# EAGLE board SCH1001-001-009-320 - ALU Bottom (EAGLE 9.4.2), part 1 of 2
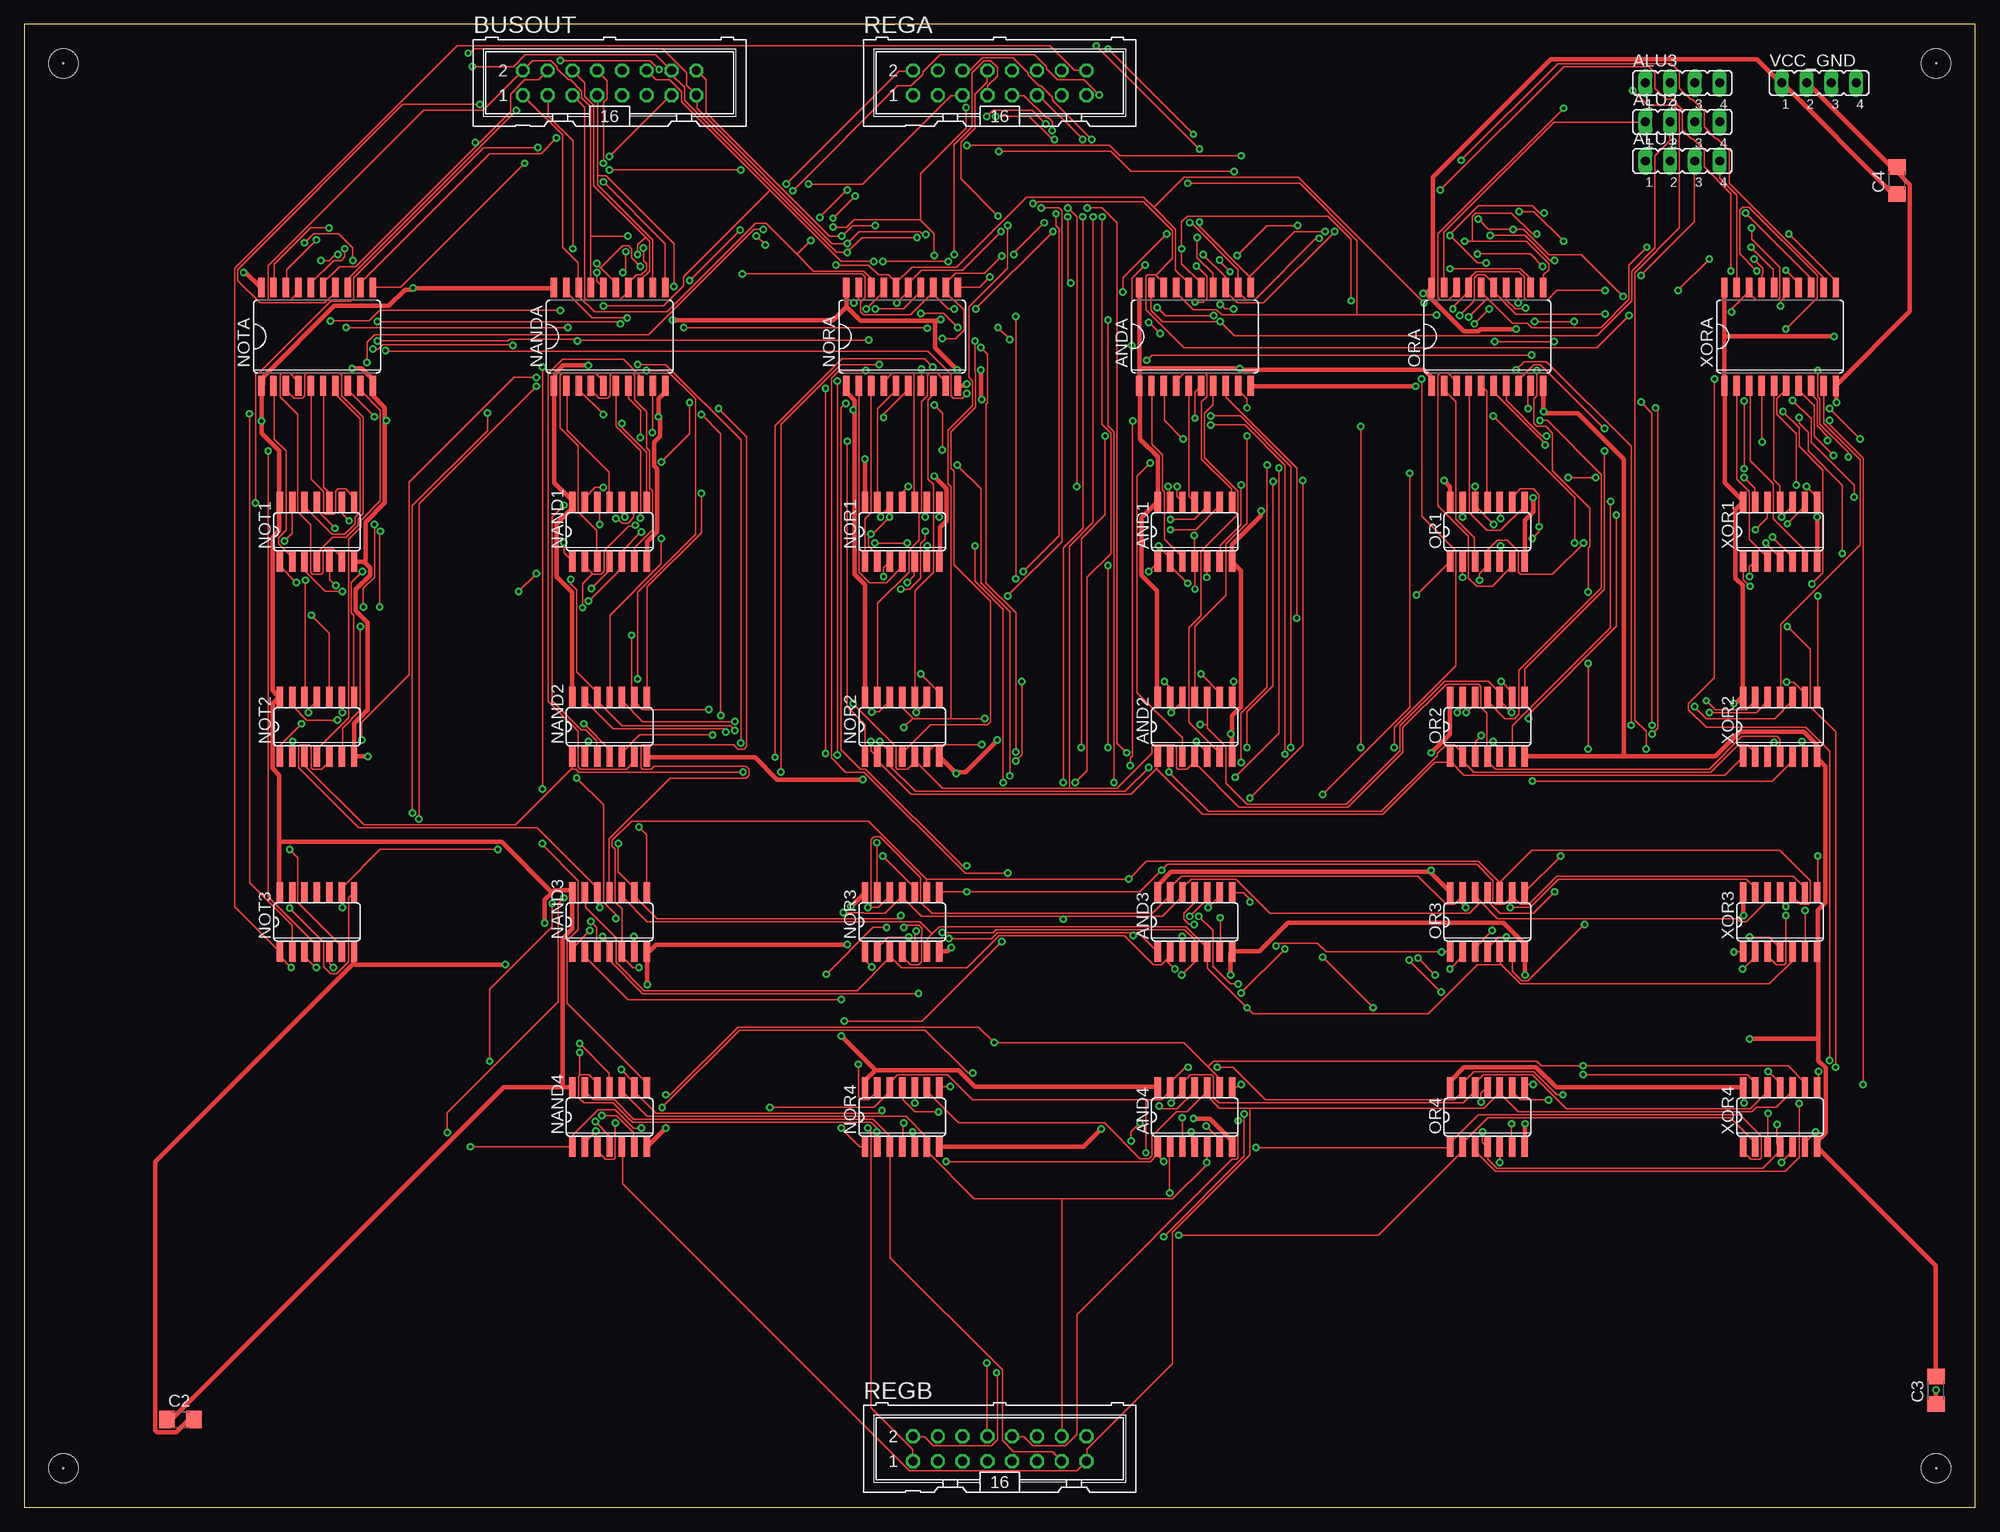
[diagram p3: board, top side]
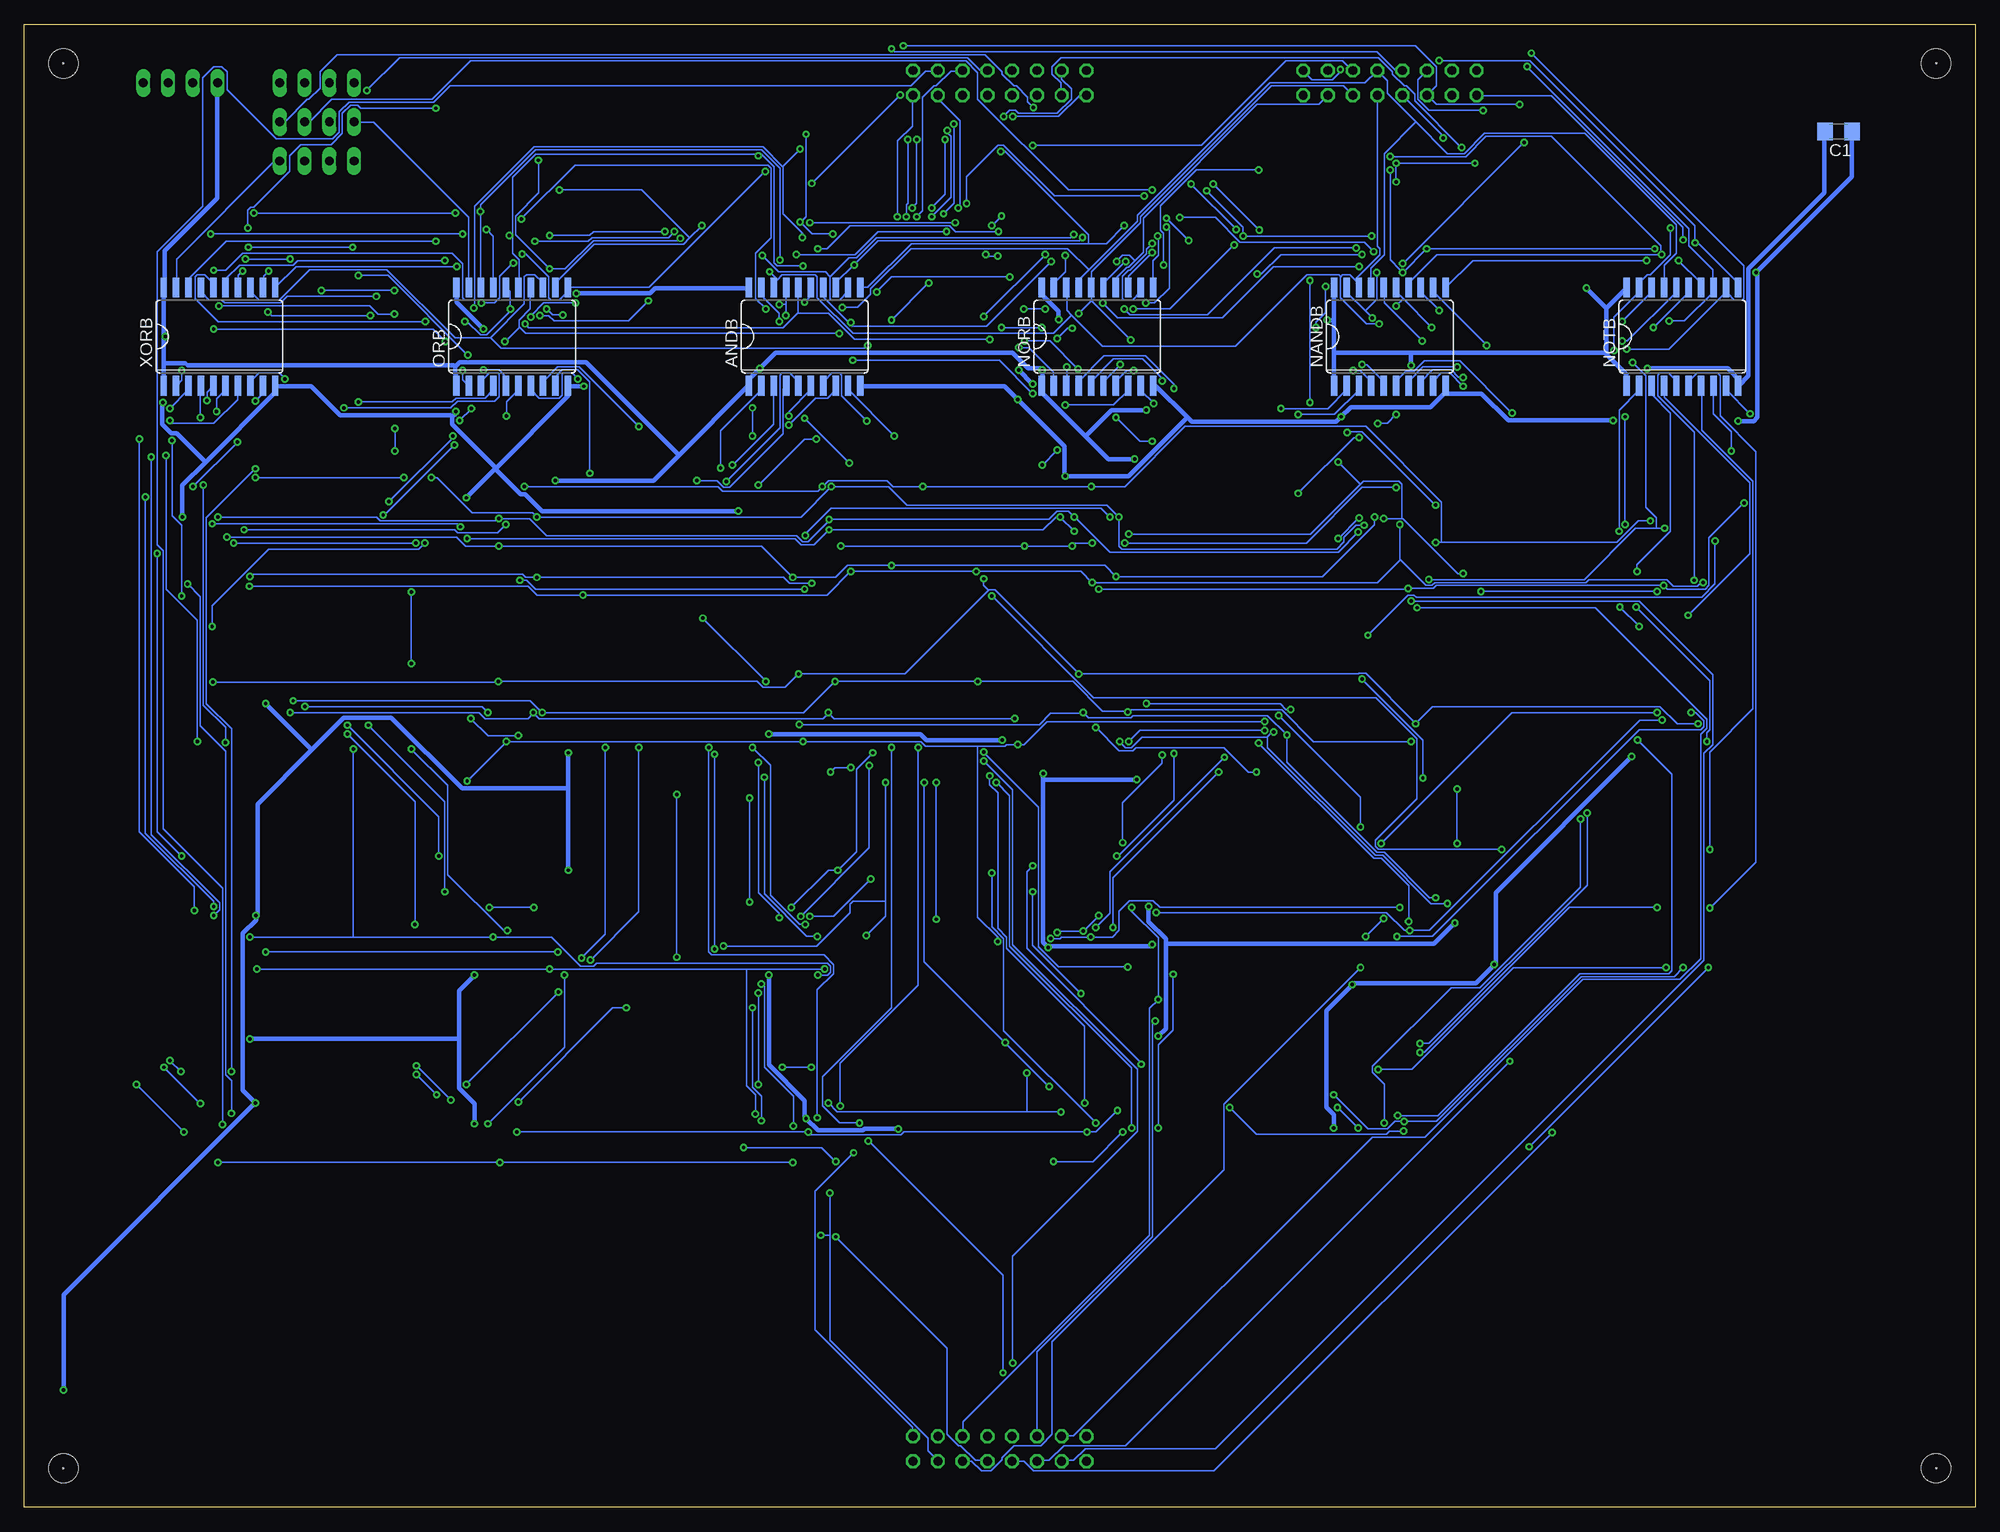
[diagram p4: board, bottom side, seen from below]

Size 200 x 152 mm. Coordinates in mm from the lower left corner, seen from the top.
Outline: 0,0 200,0 200,152 0,152 0,0
Copper layers (1*16): Top 0.035mm / dielectric 1.5mm / Bottom 0.035mm
Design rules "default *": minimum track width 6mil, minimum drill 0.35mm, track to track 6mil, track to pad 6mil, pad to pad 6mil, via to via 6mil, smd to smd 6mil, copper to edge 40mil, drill to drill 6mil, minimum pad ring 10mil, minimum via ring 8mil, stop-mask expansion 4mil, vias tented up to drill 0mil, thermal gap 10mil
Net classes: 1 power: width 0.457 mm
Holes 0.12 mm at 4,4 196,148 4,148 196,4
Holes 3 mm at 4,148 4,4 196,4 196,148

## Footprints (pad centres in the part's own frame; a part is rotated, then mirrored left to right if it is on the bottom)
JP4 = drill 0.914 long: 1 -3.81,0; 2 -1.27,0; 3 1.27,0; 4 3.81,0
SO14 = smd 0.66 x 2.032: 1 -3.81,-3.073; 2 -2.54,-3.073; 3 -1.27,-3.073; 4 0,-3.073; 5 1.27,-3.073; 6 2.54,-3.073; 7 3.81,-3.073; 8 3.81,3.073; 9 2.54,3.073; 10 1.27,3.073; 11 0,3.073; 12 -1.27,3.073; 13 -2.54,3.073; 14 -3.81,3.073
SO20W = smd 0.66 x 2.032: 1 -5.715,-5.029; 2 -4.445,-5.029; 3 -3.175,-5.029; 4 -1.905,-5.029; 5 -0.635,-5.029; 6 0.635,-5.029; 7 1.905,-5.029; 8 3.175,-5.029; 9 4.445,-5.029; 10 5.715,-5.029; 11 5.715,5.029; 12 4.445,5.029; 13 3.175,5.029; 14 1.905,5.029; 15 0.635,5.029; 16 -0.635,5.029; 17 -1.905,5.029; 18 -3.175,5.029; 19 -4.445,5.029; 20 -5.715,5.029
ML16 = drill 0.914 octagon: 1 -8.89,-1.27; 2 -8.89,1.27; 3 -6.35,-1.27; 4 -6.35,1.27; 5 -3.81,-1.27; 6 -3.81,1.27; 7 -1.27,-1.27; 8 -1.27,1.27; 9 1.27,-1.27; 10 1.27,1.27; 11 3.81,-1.27; 12 3.81,1.27; 13 6.35,-1.27; 14 6.35,1.27; 15 8.89,-1.27; 16 8.89,1.27
C1206 = smd 1.6 x 1.8: 1 -1.4,0; 2 1.4,0

## Placement (x,y rotation side)
ALU1  [JP4]  170,138 0 top
ALU2  [JP4]  170,142 0 top
ALU3  [JP4]  170,146 0 top
AND1  74ALS08D  [SO14]  120,100 0 top
AND2  74ALS08D  [SO14]  120,80 0 top
AND3  74ALS08D  [SO14]  120,60 0 top
AND4  74ALS08D  [SO14]  120,40 0 top
ANDA  74AC245DW  [SO20W]  120,120 0 top
ANDB  74AC245DW  [SO20W]  120,120 0 bottom
BUSOUT  [ML16]  60,146 0 top
C1  1uF  [C1206]  14,141 180 bottom
C2  1uF  [C1206]  16,9 0 top
C3  1uF  [C1206]  196,12 90 top
C4  1uF  [C1206]  192,136 90 top
NAND1  74ALS00D  [SO14]  60,100 0 top
NAND2  74ALS00D  [SO14]  60,80 0 top
NAND3  74ALS00D  [SO14]  60,60 0 top
NAND4  74ALS00D  [SO14]  60,40 0 top
NANDA  74AC245DW  [SO20W]  60,120 0 top
NANDB  74AC245DW  [SO20W]  60,120 0 bottom
NOR1  74ALS02D  [SO14]  90,100 0 top
NOR2  74ALS02D  [SO14]  90,80 0 top
NOR3  74ALS02D  [SO14]  90,60 0 top
NOR4  74ALS02D  [SO14]  90,40 0 top
NORA  74AC245DW  [SO20W]  90,120 0 top
NORB  74AC245DW  [SO20W]  90,120 0 bottom
NOT1  74ALS04D  [SO14]  30,100 0 top
NOT2  74ALS04D  [SO14]  30,80 0 top
NOT3  74ALS04D  [SO14]  30,60 0 top
NOTA  74AC245DW  [SO20W]  30,120 0 top
NOTB  74AC245DW  [SO20W]  30,120 0 bottom
OR1  74LS32D  [SO14]  150,100 0 top
OR2  74LS32D  [SO14]  150,80 0 top
OR3  74LS32D  [SO14]  150,60 0 top
OR4  74LS32D  [SO14]  150,40 0 top
ORA  74AC245DW  [SO20W]  150,120 0 top
ORB  74AC245DW  [SO20W]  150,120 0 bottom
REGA  [ML16]  100,146 0 top
REGB  [ML16]  100,6 0 top
VCC_GND  [JP4]  184,146 0 top
XOR1  74LS86D  [SO14]  180,100 0 top
XOR2  74LS86D  [SO14]  180,80 0 top
XOR3  74LS86D  [SO14]  180,60 0 top
XOR4  74LS86D  [SO14]  180,40 0 top
XORA  74AC245DW  [SO20W]  180,120 0 top
XORB  74AC245DW  [SO20W]  180,120 0 bottom

## Tracks (layer width: path | path; a pad name or v marks a point on that pad's centre or on a via)
!AND  (via drill 0.35)
  Top 0.152: ANDA.19 115.52,124.97 115.52,122.68 116.66,121.54 v122.61,121.54 124.05,120.09 161.24,120.09 164.82,123.67 164.82,126.72 167.18,129.08 167.18,138.53 168.71,140.06 168.71,141.96 ALU2.2
  Bottom 0.152: v122.61,121.54 122.61,122.38 124.44,124.21 124.44,124.97 ANDB.19
!NAND  (via drill 0.35)
  Top 0.152: v61.8,121.92 58.22,121.92 55.63,124.51 55.63,124.97 NANDA.19 | v81.53,132.21 v84.35,135.03 | v61.65,128.7 61.65,126.87 v61.34,126.57
  Bottom 0.152: 62.52,122.64 64.39,124.51 64.39,124.97 NANDB.19 | 62.52,122.64 v61.8,121.92 | v84.35,135.03 92.96,135.03 102.26,144.32 102.26,147.07 103.48,148.28 154.23,148.28 158.19,144.32 168.48,144.32 170.76,142.04 171.22,142.04 ALU2.3 | v81.53,132.21 77.88,132.21 75.36,129.69 62.64,129.69 v61.65,128.7 | v61.34,126.57 61.34,123.83 62.52,122.64
!NOR  (via drill 0.35)
  Top 0.152: v85.04,123.44 85.5,123.9 85.5,124.97 NORA.19 | v82.91,131.22 84.28,131.22 85.04,131.98 91.82,131.98 91.86,131.94 | 91.86,131.94 93.27,130.53 v93.27,128.32 | v96.55,143.49 96.55,141.35 91.9,136.7 91.9,131.98 91.86,131.94
  Bottom 0.152: v85.04,123.44 84.12,123.44 82.6,124.97 82.6,130.91 v82.91,131.22 | v93.27,128.32 93.27,126.64 94.41,125.5 94.41,125.04 NORB.19 | v96.55,143.49 97.16,144.09 97.16,144.55 98.3,145.69 98.53,145.69 99.75,146.91 99.75,147.14 101.5,148.9 167.94,148.9 169.7,147.14 169.7,145.47 170.84,144.32 170.99,144.32 173.28,142.04 173.74,142.04 ALU2.4
!NOT  (via drill 0.35)
  Top 0.152: v31.24,131.14 29.34,131.14 25.6,127.41 25.6,125.04 NOTA.19 | v165.74,126.26 171.22,131.75 171.22,138 ALU1.3 | v154.53,118.11 115.59,118.11 v115.06,117.58 | v96.62,114.15 96.16,113.69 95.25,113.69 95.02,113.92 95.02,116.13 92.66,118.49 37.11,118.49 v37.03,118.57
  Bottom 0.152: v31.24,131.14 31.24,128.4 33.3,126.34 33.6,126.34 34.44,125.5 34.44,125.04 NOTB.19 34.52,124.97 34.52,124.51 37.03,122 v37.03,118.57 | v165.74,126.26 162.69,126.26 v154.53,118.11 | v115.06,117.58 100.05,117.58 v96.62,114.15
!OR
  Top 0.152: ORA.19 145.54,125.04 145.54,130.68 156.82,141.96 166.12,141.96 ALU2.1
  Bottom 0.152: ORB.19 154.46,125.04 154.46,132.21 164.21,141.96 166.12,141.96 ALU2.1
!XOR
  Top 0.152: XORA.19 175.56,125.04 175.56,134.49 173.81,136.25 ALU1.4
  Bottom 0.152: XORB.19 184.4,125.04 184.4,127.94 174.35,138 ALU1.4
BUSOUT0  (via drill 0.35)
  Top 0.152: v29.95,129.92 26.9,126.87 26.9,125.04 NOTA.18 | BUSOUT.1 51.13,144.7 55.17,140.66 55.17,129.16 56.77,127.56 56.77,125.04 NANDA.18 56.84,124.97 56.84,124.13 58.45,122.53 65.91,122.53 74.98,131.6 76.05,131.6 79.21,128.44 | 79.21,128.44 80.92,126.72 86.03,126.72 86.79,125.96 86.79,125.04 NORA.18 | 116.01,126.3 115.98,126.34 115.14,126.34 114.99,126.19 114.99,122.76 118.87,118.87 161.24,118.87 v164.52,122.15 | 116.01,126.3 116.81,125.5 116.81,125.04 ANDA.18 | v175.03,122.53 175.03,122.83 176.78,124.59 176.78,124.97 XORA.18 176.78,124.51 177.55,123.75 179.76,123.75 179.98,123.98 179.98,127.1 177.09,130 v177.09,131.14 | v157.81,143.41 144.93,130.53 144.93,123.98 145.16,123.75 146,123.75 146.76,124.51 146.76,124.97 ORA.18 | v80.62,129.84 79.21,128.44 | v85.19,134.42 v82.91,132.13 | v103.4,133.66 103.78,133.66 103.94,133.81 114.76,133.81 117.73,130.84 117.73,128.02 116.01,126.3
  Bottom 0.152: v29.95,129.92 29.95,131.22 43.43,144.7 51.05,144.7 BUSOUT.1 | v164.52,122.15 174.65,122.15 v175.03,122.53 | v157.81,143.41 165.51,143.41 165.81,143.71 166.57,143.71 167.41,142.88 167.41,140.82 168.55,139.68 171.68,139.68 172.82,138.53 172.82,136.93 176.48,133.27 176.78,133.27 177.09,132.97 v177.09,131.14 | v82.91,132.13 v80.62,129.84 | v85.19,134.42 94.41,134.42 99.59,139.6 100.2,139.6 103.4,136.4 v103.4,133.66
BUSOUT1  (via drill 0.35)
  Top 0.152: v144.78,122.22 136.63,122.22 | 136.63,122.22 122.76,122.22 122.22,122.76 119.86,122.76 118.11,124.51 118.11,124.97 ANDA.17 | v146.46,122.83 146.46,122.99 148.06,124.59 148.06,124.97 ORA.17 148.13,125.04 148.13,125.96 148.82,126.64 153.24,126.64 153.77,126.11 153.77,123.98 154,123.75 156.13,123.75 157.12,124.74 v162.08,124.74 | v177.32,127.94 178.23,127.03 178.23,126.42 178.16,126.34 178.16,125.04 XORA.17 | v169.54,124.74 v172.75,127.94 | NOTA.17 28.04,124.97 28.04,124.51 27.28,123.75 25.15,123.75 24.99,123.9 24.99,127.25 40.92,143.18 47.02,143.18 51.05,147.22 BUSOUT.2 51.13,147.29 52.12,148.28 54.03,148.28 54.63,147.68 54.63,147.45 55.78,146.3 56.01,146.3 57.15,145.16 57.15,144.47 58.06,143.56 58.06,130.3 | 58.06,130.3 58.06,125.04 NANDA.17 | v86.33,122.83 88.09,124.59 88.09,124.97 NORA.17 | v75.06,130.3 v75.97,129.39 | 58.06,130.3 v61.87,130.3 | 136.63,122.22 136.63,129.84 130.76,135.71 v119.25,135.71 | v110.19,144.78 108.66,146.3 105.92,146.3 104.78,147.45 104.78,147.68 103.56,148.9 93.88,148.9 92.13,147.14 92.13,146.91 90.91,145.69 89.53,145.69 v78.79,134.95
  Bottom 0.152: v144.78,122.22 145.85,122.22 v146.46,122.83 | v172.75,127.94 v177.32,127.94 | v162.08,124.74 v169.54,124.74 | v86.33,122.83 82.53,122.83 v75.97,129.39 | v61.87,130.3 v75.06,130.3 75.06,131.22 v78.79,134.95 | v110.19,144.78 v119.25,135.71
BUSOUT2  (via drill 0.35)
  Top 0.152: v32.84,129.01 32.84,128.17 32.46,127.79 31.7,127.79 29.41,125.5 29.41,125.04 NOTA.16 | v58.67,126.57 58.67,125.73 59.36,125.04 NANDA.16 | v56.24,129.01 56.24,140.06 53.72,142.57 53.72,144.7 BUSOUT.3 | 150,123.94 152.55,121.39 154.08,121.39 154.53,120.93 161.62,120.93 164.52,123.83 164.52,127.33 v166.34,129.16 | 150,123.94 149.43,124.51 149.43,124.97 ORA.16 | v177.01,129.16 179.3,126.87 179.3,125.04 XORA.16 | 115.79,133.24 118.03,130.99 118.03,126.8 119.33,125.5 119.33,125.04 ANDA.16 | 115.79,133.24 114.76,134.26 102.72,134.26 95.56,127.1 90.98,127.1 89.38,125.5 89.38,125.04 NORA.16 89.38,125.58 88.62,126.34 87.55,126.34 86.56,127.33 v83.21,127.33 | v148.06,122 150,123.94 | v143.49,123.44 130.61,136.32 118.87,136.32 115.79,133.24 | v73.46,137.08 v59.97,137.08
  Bottom 0.152: v32.84,129.01 v56.24,129.01 v58.67,126.57 58.67,126.64 58.9,126.87 58.98,126.87 59.97,127.86 v59.97,137.08 | v177.01,129.16 v166.34,129.16 | v148.06,122 148.06,122.15 146.76,123.44 v143.49,123.44 | v73.46,137.08 79.86,137.08 83.52,133.43 83.52,130.91 83.21,130.61 v83.21,127.33
BUSOUT3  (via drill 0.35)
  Top 0.152: 46.48,139.68 49.84,143.03 49.84,144.86 51.28,146.3 52.73,146.3 53.65,147.22 BUSOUT.4 | 46.48,139.68 33.98,127.18 32.31,127.18 30.71,125.58 30.71,125.04 NOTA.15 | v58.67,127.48 59.09,127.06 | 59.09,127.06 60.58,125.58 60.58,125.04 NANDA.15 | 46.48,139.68 v46.25,139.9 | v162.08,122.3 152.93,122.3 150.65,124.59 150.65,124.97 ORA.15 150.57,125.04 150.57,125.5 149.73,126.34 148.97,126.34 148.67,126.03 148.67,123.67 v147.14,122.15 | v180.06,123.14 180.06,123.6 180.59,124.13 180.59,124.97 XORA.15 | v100.13,130.76 96.16,126.8 91.97,126.8 90.68,125.5 90.68,125.04 NORA.15 90.6,124.97 90.6,124.59 v89.46,123.44 | ANDA.15 120.62,125.04 120.62,125.5 118.64,127.48 v118.64,129.01 118.64,131.75 119.25,132.36 133.66,132.36 136.02,130 v136.02,123.67 | 59.09,127.06 61.34,129.31 61.95,129.31 62.26,129.01 62.26,128.09 v63.17,127.18
  Bottom 0.152: v46.25,139.9 v58.67,127.48 | v162.08,122.3 163.75,122.3 164.59,123.14 v180.06,123.14 | v100.13,130.76 104.55,130.76 105.16,131.37 115.37,131.37 117.73,129.01 v118.64,129.01 | v147.14,122.15 146.23,122.15 145.69,121.61 138.07,121.61 v136.02,123.67 | v63.17,127.18 71.93,127.18 77.19,121.92 87.94,121.92 v89.46,123.44
BUSOUT4  (via drill 0.35)
  Top 0.152: v120.24,130.15 120.24,128.09 121.84,126.49 121.84,125.04 ANDA.14 | v153.92,122.91 153.54,122.91 153.47,122.83 152.86,122.83 151.94,123.75 151.94,124.97 ORA.14 | v180.59,126.8 181.89,125.5 181.89,125.04 XORA.14 | v46.71,143.79 38.79,143.79 21.87,126.87 21.87,125.73 24.16,123.44 30.79,123.44 31.85,124.51 31.85,124.97 NOTA.14 | BUSOUT.5 56.24,144.7 57.45,143.49 57.45,123.98 57.68,123.75 61.04,123.75 61.87,124.59 61.87,124.97 NANDA.14 61.95,125.04 61.95,125.5 62.79,126.34 63.25,126.34 63.78,126.87 63.78,127.48 63.48,127.79 v63.48,129.08 | v87.25,122.83 90.14,122.83 91.9,124.59 91.9,124.97 NORA.14 | v109.88,149.81 v120.47,139.22
  Bottom 0.152: v120.24,130.15 120.24,130.61 122.22,132.59 122.22,137.39 122.26,137.43 | 122.26,137.43 124.28,139.45 147.75,139.45 153.85,133.35 153.85,123.75 | 153.85,123.75 153.85,122.99 v153.92,122.91 | v180.59,126.8 179.38,126.8 177.62,128.55 156.13,128.55 155.07,127.48 155.07,123.98 154.84,123.75 153.85,123.75 | v46.71,143.79 55.24,143.79 56.16,144.7 BUSOUT.5 56.16,144.78 55.24,145.69 55.24,147.68 57.38,149.81 v109.88,149.81 | v87.25,122.83 86.64,122.22 78.72,122.22 71.86,129.08 v63.48,129.08 | v120.47,139.22 122.26,137.43
BUSOUT5  (via drill 0.35)
  Top 0.152: v50.44,143.18 33.22,125.96 33.22,125.04 NOTA.13 | 63.66,130.19 58.37,135.48 58.37,143.71 57.45,144.63 57.45,146 56.24,147.22 BUSOUT.6 | 63.66,130.19 64.08,129.77 64.08,126.72 63.25,125.88 63.25,125.04 NANDA.13 | v73.61,126.42 85.88,126.42 86.18,126.11 86.18,123.98 85.72,123.52 85.72,122.53 86.03,122.22 90.83,122.22 93.12,124.51 93.12,124.97 NORA.13 93.12,124.44 94.72,122.83 v95.33,122.83 | v62.87,128.4 62.87,129.39 63.66,130.19 | v120.85,128.4 123.14,126.11 123.14,125.04 ANDA.13 123.22,124.97 123.22,124.59 124.36,123.44 127.03,123.44 v134.34,130.76 | v97.54,122.83 v105.46,130.76 | v153.16,123.44 153.16,124.97 ORA.13 | v149.88,127.56 148.97,127.56 v146.15,130.38 146.23,130.38 146.23,130.61 149.05,133.43 154.61,133.43 155.37,132.66 v155.83,132.66 | v176.48,132.66 183.11,126.03 183.11,125.04 XORA.13
  Bottom 0.152: v50.44,143.18 56.01,143.18 57.15,144.32 57.15,146.3 56.24,147.22 BUSOUT.6 | v73.61,126.42 73.15,126.42 71.17,128.4 v62.87,128.4 | v120.85,128.4 114.83,128.4 112.47,130.76 v105.46,130.76 | v95.33,122.83 v97.54,122.83 | v153.16,123.44 151.79,123.44 151.26,123.98 151.26,126.19 v149.88,127.56 | v146.15,130.38 142.04,130.38 141.66,130.76 v134.34,130.76 | v155.83,132.66 v176.48,132.66
BUSOUT6  (via drill 0.35)
  Top 0.152: v54.56,140.36 52.96,138.76 47.7,138.76 34.52,125.58 34.52,125.04 NOTA.12 | 58.75,136.47 58.75,144.7 BUSOUT.7 | 58.75,136.47 58.75,135.56 64.39,129.92 64.39,125.04 NANDA.12 | v100.2,128.25 98.45,126.49 95.48,126.49 94.49,125.5 94.49,125.04 NORA.12 94.49,124.97 94.49,124.51 95.25,123.75 95.33,123.75 96.32,122.76 96.32,120.62 95.48,119.79 v94.11,119.79 | v101.42,128.4 101.42,128.55 v104.55,131.67 | v119.48,131.67 119.63,131.67 124.44,126.87 124.44,125.04 ANDA.12 124.51,124.97 124.51,124.51 125.27,123.75 126.11,123.75 132.44,130.07 v132.74,130.07 | v146.15,126.95 153.39,126.95 154.38,125.96 154.38,125.04 ORA.12 | v147.29,138.07 157.2,147.98 168.86,147.98 169.7,147.14 169.7,145.47 170.84,144.32 170.99,144.32 172.21,143.1 172.21,141.5 173.43,140.28 173.58,140.28 174.8,139.06 174.8,135.71 184.4,126.11 184.4,125.04 XORA.12 | 58.75,136.47 59.66,136.47 66.6,129.54 v66.6,125.12 | v67.59,120.93 92.51,120.93 v92.58,120.85
  Bottom 0.152: v54.56,140.36 54.56,140.59 58.67,144.7 BUSOUT.7 | v100.2,128.25 101.27,128.25 v101.42,128.4 | v119.48,131.67 v104.55,131.67 | v132.74,130.07 132.97,129.84 141.66,129.84 144.55,126.95 v146.15,126.95 149.66,130.45 149.66,132.36 147.29,134.72 v147.29,138.07 | v66.6,125.12 66.6,122.45 67.59,121.46 v67.59,120.93 | v92.58,120.85 93.04,120.85 v94.11,119.79
BUSOUT7  (via drill 0.35)
  Top 0.152: v51.28,137.77 38.56,125.04 35.74,125.04 NOTA.11 | v59.36,137.77 59.36,144.02 59.74,144.4 59.74,146.23 58.75,147.22 BUSOUT.8 | v59.36,135.87 65.68,129.54 65.68,125.04 NANDA.11 | v98.98,126.11 97.92,125.04 95.78,125.04 NORA.11 | v112.62,124.59 112.62,126.03 v117.12,130.53 | v120.47,131.75 120.47,131.29 125.62,126.15 | 125.62,126.15 125.65,126.11 125.65,125.04 ANDA.11 | v147.68,129.77 148.44,129.77 | 148.44,129.77 154,129.77 156.29,127.48 156.29,126.87 155.75,126.34 155.75,125.04 ORA.11 | v133.35,130.76 130.23,130.76 125.62,126.15 | v180.9,130.53 185.7,125.73 185.7,125.04 XORA.11 | v155.07,130.53 154.61,130.53 152.48,132.66 148.74,132.66 148.44,132.36 148.44,129.77 | v119.86,140.74 v111.1,149.5
  Bottom 0.152: v51.28,137.77 v59.36,137.77 v59.36,135.87 | v98.98,126.11 111.1,126.11 v112.62,124.59 | v117.12,130.53 119.25,130.53 v120.47,131.75 120.4,131.75 119.86,132.28 v119.86,140.74 | v147.68,129.77 142.19,129.77 141.81,130.15 133.96,130.15 v133.35,130.76 | v155.07,130.53 v180.9,130.53 | v111.1,149.5 110.8,149.2 61.34,149.2 59.44,147.29 58.75,147.29 BUSOUT.8
BUSOUT8  (via drill 0.35)
  Top 0.152: v153.24,132.82 154.76,132.82 v157.81,129.77 | v36.2,121.54 60.88,121.54 v61.11,121.31 | v122.53,127.86 122.53,127.71 v123.6,126.64
  Bottom 0.152: v157.81,129.77 179.3,129.77 183.11,125.96 183.11,125.04 XORB.18 | ORB.18 153.24,125.04 v153.24,132.82 153.24,133.5 147.6,139.14 124.44,139.14 122.53,137.24 v122.53,127.86 | v36.2,121.54 33.22,124.51 33.22,124.97 NOTB.18 | v61.11,121.31 62.41,121.31 65.08,123.98 65.08,126.11 65.04,126.15 | 65.04,126.15 64.85,126.34 64.08,126.34 63.59,125.84 | 63.59,125.84 63.25,125.5 63.25,125.04 NANDB.18 | 92.62,122.19 89.46,119.02 75.82,119.02 68.5,126.34 65.23,126.34 65.04,126.15 | 92.62,122.19 93.12,122.68 93.12,124.97 NORB.18 | 122.8,125.84 122.3,126.34 118.95,126.34 118.72,126.11 118.72,123.98 115.06,120.32 94.49,120.32 92.62,122.19 | 122.8,125.84 123.14,125.5 123.14,125.04 ANDB.18 | 63.59,125.84 61.04,128.4 61.04,129.01 61.27,129.24 61.27,144.7 BUSOUT.9 | 122.8,125.84 v123.6,126.64
BUSOUT9  (via drill 0.35)
  Top 0.152: v163.91,124.13 159.64,128.4 156.29,128.4 153.69,130.99 v152.63,130.99 150.11,130.99 v149.05,132.06 | v121.92,122.15 116.97,122.15 v116.13,122.99 | v123.98,122.83 123.06,122.83 v122.61,123.29
  Bottom 0.152: v152.63,130.99 151.94,130.3 151.94,125.04 ORB.17 | v163.91,124.13 173.05,124.13 173.74,123.44 179.45,123.44 179.76,123.75 181.05,123.75 181.89,124.59 181.89,124.97 XORB.17 | 57.34,142 60.27,144.93 60.27,146.23 61.27,147.22 BUSOUT.10 61.34,147.22 62.56,146 72.31,146 85.88,132.44 85.88,131.83 90.87,126.83 | 57.34,142 54.1,138.76 52.35,138.76 50.29,140.82 40.01,140.82 30.63,131.44 30.63,128.55 31.85,127.33 31.85,125.04 NOTB.17 | 57.34,142 60.58,138.76 60.58,128.4 61.95,127.03 61.95,125.04 NANDB.17 | 90.87,126.83 91.9,125.81 91.9,125.04 NORB.17 | v121.92,122.15 121.92,123.29 | 121.92,123.29 121.92,124.97 ANDB.17 | v116.13,122.99 114.61,122.99 113.23,124.36 113.23,124.89 109.12,129.01 93.04,129.01 90.87,126.83 | v149.05,132.06 143.56,137.54 123.75,137.54 123.44,137.24 123.44,130.15 125.04,128.55 125.04,123.9 v123.98,122.83 | 121.92,123.29 v122.61,123.29
BUSOUT10  (via drill 0.35)
  Top 0.152: v150.19,122.83 v148.67,121.31 | v154.84,121.54 v158.88,121.54 | v36.2,119.56 49.61,119.56 49.76,119.71 56.54,119.71 v56.69,119.56 56.69,119.63 v86.56,119.63 | v99.82,120.93 v101.04,119.71 | v95.71,120.93 94.26,122.38 v91.9,122.38
  Bottom 0.152: 120.74,122.42 122.22,120.93 148.28,120.93 v148.67,121.31 | 120.74,122.42 120.7,122.45 120.7,124.97 ANDB.16 | ORB.16 150.57,124.97 150.19,124.59 v150.19,122.83 150.19,122.61 152.63,120.17 153.24,120.17 154.61,121.54 v154.84,121.54 | v158.88,121.54 180.14,121.54 182.5,123.9 182.5,126.11 182.27,126.34 181.51,126.34 180.67,125.5 180.67,125.04 XORB.16 | v36.2,119.56 35.66,119.56 30.71,124.51 30.71,124.97 NOTB.16 | v56.69,119.56 60.58,123.44 60.58,124.97 NANDB.16 | BUSOUT.11 63.86,144.78 64.77,145.69 72.16,145.69 85.57,132.28 85.57,131.67 90.6,126.64 90.6,125.04 NORB.16 90.6,124.97 90.6,123.67 | 90.6,123.67 v86.56,119.63 | v101.04,119.71 114.91,119.71 117.58,122.38 120.7,122.38 120.74,122.42 | v95.71,120.93 v99.82,120.93 | 90.6,123.67 v91.9,122.38
BUSOUT11  (via drill 0.35)
  Top 0.152: v120.02,123.52 120.85,123.52 121.23,123.9 121.23,126.19 v120.17,127.25 | v156.9,127.79 156.44,127.79 153.85,130.38 v150.27,130.38 | v55.7,120.93 v32.99,120.93 | v87.1,127.71 83.74,127.71 76.47,134.99 | 76.47,134.99 67.36,144.09 67.36,145.09 66.14,146.3 64.77,146.3 63.86,147.22 BUSOUT.12 | v59.36,123.14 65.53,123.14 67.59,125.2 67.59,126.11 76.47,134.99 | v124.74,138.53 112.32,138.53 111.25,139.6 v96.62,139.6
  Bottom 0.152: v120.02,123.52 119.41,124.13 119.41,124.97 ANDB.15 | v120.17,127.25 122.83,127.25 123.14,127.56 123.14,137.39 124.44,138.68 124.74,138.68 | 124.74,138.68 147.6,138.68 149.96,136.32 149.96,130.38 | 149.96,130.38 149.96,128.55 149.28,127.86 149.28,125.12 149.35,125.04 ORB.15 | v156.9,127.79 171.98,127.79 172.44,127.33 177.93,127.33 179.3,125.96 179.3,125.04 XORB.15 | 149.96,130.38 v150.27,130.38 | v32.99,120.93 29.41,124.51 29.41,124.97 NOTB.15 | 58.64,123.86 59.36,124.59 59.36,124.97 NANDB.15 | 58.64,123.86 v55.7,120.93 | v87.1,127.71 89.31,125.5 89.31,125.04 NORB.15 | v59.36,123.14 58.64,123.86 | v124.74,138.53 124.74,138.68 | v96.62,139.6 79.32,139.6 70.64,148.28 64.85,148.28 63.86,147.29 BUSOUT.12
BUSOUT12  (via drill 0.35)
  Top 0.152: v30.4,127.79 31.24,127.79 31.85,128.4 v32.16,128.4 | v88.01,127.71 v94.72,127.71 | v115.29,121.46 v116.43,120.32 | v177.62,126.72 175.87,128.47 175.87,132.97 176.17,133.27 176.78,133.27 183.79,126.26 183.79,123.98 v180.59,120.78 | v150.72,119.48 v156.82,119.48 | v59.97,138.46 66.29,144.78 BUSOUT.13
  Bottom 0.152: v30.4,127.79 28.12,125.5 28.12,125.04 NOTB.14 | 32.23,128.4 55.17,128.4 58.06,125.5 58.06,125.04 NANDB.14 | 86.14,127.75 85.27,128.63 85.27,132.13 73.61,143.79 67.28,143.79 66.37,144.7 BUSOUT.13 | 86.14,127.75 86.79,127.1 86.94,127.1 88.09,125.96 88.09,125.04 NORB.14 | 115.41,121.35 115.14,121.08 101.35,121.08 v94.72,127.71 | 115.41,121.35 118.03,123.98 118.03,124.97 ANDB.14 | v88.01,127.71 87.4,128.32 86.72,128.32 86.14,127.75 | 149.24,120.97 148.59,120.32 v116.43,120.32 | 149.24,120.97 149.28,121.01 149.28,121.69 148.13,122.83 148.13,124.97 ORB.14 | 115.41,121.35 v115.29,121.46 | v177.62,126.72 178.08,126.26 178.08,125.04 XORB.14 | v180.59,120.78 158.12,120.78 v156.82,119.48 | 149.24,120.97 v150.72,119.48 | 32.23,128.4 32.23,129.31 43.43,140.51 50.14,140.51 52.2,138.46 v59.97,138.46 | 32.23,128.4 v32.16,128.4
BUSOUT13  (via drill 0.35)
  Top 0.152: v31.39,121.61 35.36,121.61 36.42,122.68 v54.94,122.68 | v91.52,130.15 85.88,130.15 v84.35,128.63 83.29,128.63 67.67,144.25 67.67,145.54 66.37,146.84 66.37,147.22 BUSOUT.14 66.29,147.29 64.69,148.9 51.36,148.9 50.14,147.68 v45.95,147.68 | v113.54,119.1 113.54,125.96 v114.91,127.33
  Bottom 0.152: 152.21,119.9 152.25,119.86 155.83,119.86 162.84,126.87 170.76,126.87 173.89,123.75 175.95,123.75 176.78,124.59 176.78,124.97 XORB.13 | 152.21,119.9 148.74,123.37 148.74,126.11 148.51,126.34 147.68,126.34 146.84,125.5 146.84,125.04 ORB.13 | v31.39,121.61 29.79,121.61 26.9,124.51 26.9,124.97 NOTB.13 26.9,125.04 26.9,126.87 29.34,129.31 29.34,131.06 v45.95,147.68 | v54.94,122.68 56.77,124.51 56.77,124.97 NANDB.13 | v84.35,128.63 86.79,126.19 86.79,125.04 NORB.13 | 114.95,127.37 112.47,129.84 91.82,129.84 v91.52,130.15 | 114.95,127.37 116.81,125.5 116.81,125.04 ANDB.13 | 152.21,119.9 151.1,118.8 113.84,118.8 v113.54,119.1 | v114.91,127.33 114.95,127.37
BUSOUT14  (via drill 0.35)
  Top 0.152: v35.74,118.72 36.27,118.72 36.73,119.18 49.99,119.18 v50.06,119.1 | v92.43,130.45 92.13,130.45 91.82,130.76 85.57,130.76 v84.35,129.54 82.83,129.54 68.96,143.41 68.96,144.7 BUSOUT.15 68.89,144.78 67.89,145.77 67.89,147.07 65.46,149.5 46.1,149.5 45.64,149.05 v45.49,149.05 | v130.53,131.37 127.41,131.37 v124.36,128.32 | v174.96,126.72 174.96,134.65 172.21,137.39 172.21,139.14 171.07,140.28 170.92,140.28 170,141.2 170,143.26 168.94,144.32 168.33,144.32 167.18,145.47 167.18,147.07 166.57,147.68 157.81,147.68 v145.16,135.03
  Bottom 0.152: v35.74,118.72 31.39,118.72 25.6,124.51 25.6,124.97 NOTB.12 25.6,124.44 25.38,124.44 24.69,123.75 23.85,123.75 23.7,123.9 23.7,127.25 v45.49,149.05 | v50.06,119.1 55.55,124.59 55.55,124.97 NANDB.12 | v84.35,129.54 84.96,128.93 84.96,128.47 86.64,126.8 86.79,126.8 87.4,126.19 87.4,123.9 87.25,123.75 86.41,123.75 85.57,124.59 85.57,124.97 NORB.12 | 117.39,126.15 115.44,128.09 114.68,128.09 112.62,130.15 92.73,130.15 v92.43,130.45 | 117.39,126.15 117.42,126.11 117.42,123.9 117.27,123.75 116.43,123.75 115.59,124.59 115.59,124.97 ANDB.12 | v130.53,131.37 131.79,130.11 | 131.79,130.11 132.44,129.46 141.58,129.46 145.54,125.5 145.54,125.04 ORB.12 | v124.36,128.32 122.68,126.64 117.88,126.64 117.39,126.15 | v174.96,126.72 175.49,126.19 175.49,125.04 XORB.12 | v145.16,135.03 136.7,135.03 131.79,130.11
BUSOUT15  (via drill 0.35)
  Top 0.152: v28.73,129.62 29.64,130.53 32.23,130.53 33.68,129.08 v33.68,127.79 | v148.97,128.47 154.38,128.47 v155.68,127.18 | BUSOUT.16 68.96,147.22 69.88,146.3 69.88,142.95 82.53,130.3 v83.82,130.3 84.89,131.37 v87.25,131.37 | v124.05,136.93 113.46,136.93 111.4,138.99 v99.9,138.99 | v54.94,148.28 64.16,148.28 v65.08,147.37
  Bottom 0.152: v33.68,127.79 51.51,127.79 54.25,125.04 NANDB.11 | NOTB.11 24.31,125.04 24.31,125.5 28.42,129.62 v28.73,129.62 28.73,131.37 45.64,148.28 v54.94,148.28 | v148.97,128.47 148.59,128.47 146.23,126.11 146.23,123.98 146,123.75 145.16,123.75 144.32,124.59 144.32,124.97 ORB.11 144.25,125.04 135.94,125.04 v124.05,136.93 | v155.68,127.18 172.14,127.18 174.27,125.04 XORB.11 | v83.82,130.3 83.74,130.23 83.74,128.32 84.28,127.79 84.28,125.04 NORB.11 | 90.91,129.54 89.08,129.54 v87.25,131.37 | 90.91,129.54 109.04,129.54 113.54,125.04 114.22,125.04 ANDB.11 | v99.9,138.99 99.44,138.99 90.91,130.45 90.91,129.54 | v65.08,147.37 65.08,147.14 65.91,146.3 67.97,146.3 68.89,147.22 BUSOUT.16
GND  (via drill 0.35)
  Top 0.457: v95.02,57.38 94.64,57 93.88,57 NOR3.7 | NOR2.7 93.88,76.89 v95.56,75.21 95.71,75.36 96.47,75.36 v99.75,78.64 | v85.95,74.6 77.19,74.6 74.91,76.89 63.86,76.89 NAND2.7 | v65.76,38.86 63.86,36.96 NAND4.7 | v63.86,53.57 63.86,56.92 NAND3.7 64.08,57 64.77,57.68 v84.35,57.68 | 33.76,55.78 13.41,35.43 13.41,7.92 13.64,7.7 15.54,7.7 16.84,8.99 17.37,8.99 C2.2 | 33.76,55.78 33.76,56.92 NOT3.7 | v49.3,55.63 33.91,55.63 33.76,55.78 | NANDA.10 65.68,114.91 65.68,114.3 65,113.61 v65,111.78 65.15,111.63 65.15,109.8 64.54,109.19 64.54,106.76 64.85,106.45 64.85,99.97 63.86,98.98 63.86,97 NAND1.7 | v93.27,105.69 94.56,104.39 94.56,101.12 93.88,100.43 93.88,97 NOR1.7 | v96.62,115.14 96.47,114.99 95.78,114.99 NORA.10 | v98.07,116.59 98.07,113.61 v98.15,113.54 | 34.82,96.93 35.43,96.32 35.43,95.56 33.98,94.11 33.98,91.9 35.2,90.68 35.2,81.76 33.83,80.39 33.83,76.96 NOT2.7 34.06,76.96 v35.2,76.96 | 34.82,96.93 33.83,96.93 NOT1.7 | 36.96,111.4 36.96,102.95 34.98,100.97 34.98,97.08 34.82,96.93 | 36.96,111.4 36.96,112.7 35.74,113.92 35.74,114.91 NOTA.10 35.59,115.14 35.59,115.75 34.59,116.74 v33.6,116.74 | v37.11,111.4 36.96,111.4 | 123.83,79.25 123.83,81.15 124.74,82.07 124.74,96.01 123.83,96.93 AND1.7 123.83,97.16 123.83,98.68 126.8,101.65 v126.8,102.11 | 123.83,79.25 123.83,76.96 AND2.7 | VCC_GND.2 182.8,146 191.34,137.47 191.95,137.47 C4.2 192.1,137.24 192.1,136.78 193.32,135.56 193.32,122.61 185.85,115.14 XORA.10 185.78,114.91 v185.78,113.23 | v142.65,114.91 125.73,114.91 ANDA.10 | v154.69,103.48 154.69,102.03 153.85,101.19 153.85,97 OR1.7 | ORA.10 155.75,114.91 v155.75,112.32 155.91,112.17 159.26,112.17 163.98,107.44 163.98,76.96
  Top 0.457: v183.79,101.5 183.79,97 XOR1.7 | v110.41,38.79 108.58,36.96 93.88,36.96 NOR4.7 | v119.86,39.85 121.54,39.85 123.75,37.64 123.75,36.96 AND4.7 | v153.85,39.32 153.85,36.96 OR4.7 | v153.85,54.56 153.85,56.69 OR3.7 153.77,57 153.77,57.76 151.64,59.89 129.54,59.89 126.64,57 123.83,57 AND3.7 123.67,56.77 v123.67,54.56 | C3.2 195.99,13.41 195.99,24.77 183.87,36.88 XOR4.7 183.95,37.11 183.95,37.64 184.71,38.41 184.71,45.03 183.95,45.8 183.95,48.01 | 163.98,76.96 173.35,76.96 175.87,79.48 182.42,79.48 183.79,78.11 183.79,76.96 XOR2.7 183.87,76.73 184.63,75.97 184.63,61.95 183.87,61.19 183.87,57 XOR3.7 183.95,56.77 183.95,48.01 | 163.98,76.96 153.85,76.96 OR2.7 | 183.95,48.01 v176.86,48.01 | v123.67,79.25 123.83,79.25
  Bottom 0.457: v95.56,75.21 95.56,74.6 | 95.56,74.6 95.56,57.91 v95.02,57.38 94.87,57.53 84.51,57.53 v84.35,57.68 | 95.56,74.6 v85.95,74.6 | v65.76,38.86 65.76,40.23 66.52,41 66.52,50.9 v63.86,53.57 63.7,53.72 51.21,53.72 v49.3,55.63 49.15,55.78 49.15,63.02 v35.2,76.96 | 80.77,111.71 80.31,111.25 65.53,111.25 v65,111.78 64.01,112.78 55.85,112.78 54.33,114.3 54.33,114.91 NANDB.10 54.18,114.15 50.6,114.15 47.85,111.4 v37.11,111.4 | 80.77,111.71 83.97,114.91 84.28,114.91 NORB.10 | 80.77,111.71 86.79,105.69 v93.27,105.69 93.34,105.84 93.34,108.74 v98.15,113.54 99.52,114.91 114.22,114.91 ANDB.10 | v98.07,116.59 v96.62,115.14 | C1.2 15.47,140.97 15.47,134.72 23.24,126.95 23.24,115.98 24.23,114.99 NOTB.10 24.08,115.44 25.38,116.74 v33.6,116.74 | v142.65,114.91 144.25,114.91 ORB.10 144.25,114.68 144.25,113.92 151.64,106.53 | 151.64,106.53 151.71,106.45 | 151.71,106.45 v154.69,103.48 | v155.75,112.32 155.75,112.17 156.13,111.78 | 156.13,111.78 156.13,111.02 151.64,106.53 | 156.13,111.78 156.29,111.94 167.64,111.94 170.61,114.91 174.27,114.91 XORB.10 174.27,114.68 174.27,114.3 181.43,107.14 | v183.79,101.5 183.79,104.78 181.43,107.14 | v185.78,113.23 185.78,113.08 185.85,113 185.85,111.02 184.94,110.11 184.4,110.11 181.43,107.14 | v126.8,102.11 146.91,102.11 148.67,103.86 149.12,103.86 151.71,106.45 | v110.41,38.79 113.84,38.79 114,38.63 118.64,38.63 v119.86,39.85 120.02,40.01 120.02,41.68 123.67,45.34 v123.67,54.56 | v153.85,39.32 153.85,41.38 155.45,42.98 155.45,48.01 | 155.45,48.01 155.45,52.96 v153.85,54.56 | v176.86,48.01 155.45,48.01 | v99.75,78.64 107.52,78.64 108.13,79.25 v123.67,79.25
N$1
  Top 0.152: NOTA.2 25.6,114.91 25.6,109.5 26.82,108.28 26.82,100.13 26.06,99.36 26.06,98.75 27.43,97.38 27.43,97 NOT1.2
N$2
  Top 0.152: NOTA.6 30.71,114.91 30.71,104.55 31.24,104.01 31.24,103.1 NOT1.10
N$3
  Top 0.152: NOT1.4 30.02,97 30.02,97.84 31.62,99.44 32.99,99.44 34.21,100.66 34.21,101.35 34.75,101.88 34.75,111.71 32.54,113.92 32.54,116.05 32.31,116.28 28.96,116.28 28.73,116.05 28.73,113.92 28.5,113.69 27.66,113.69 26.9,114.45 26.9,114.91 NOTA.3
N$4
  Top 0.152: NOT1.12 28.8,103.02 28.8,102.49 31.55,99.75 32.84,99.75 33.91,100.81 33.91,101.5 34.44,102.03 34.44,111.56 31.93,114.07 31.93,114.91 NOTA.7
N$5  (via drill 0.35)
  Top 0.152: v27.51,78.49 27.51,76.96 NOT2.2 | v34.75,92.28 34.75,94.18 35.89,95.33 v35.89,100.74 | v35.89,111.78 33.22,114.45 33.22,114.91 NOTA.8
  Bottom 0.152: v27.51,78.49 27.51,79.4 27.2,79.7 27.2,84.73 v34.75,92.28 | v35.89,111.78 v35.89,100.74
N$6
  Top 0.152: NOT1.6 32.54,97 32.54,97.38 31.7,98.22 30.86,98.22 30.63,97.99 30.63,95.86 30.4,95.63 29.57,95.63 29.34,95.86 29.34,100.74 28.04,102.03 28.04,112.01 26.21,113.84 26.21,116.05 26.44,116.28 27.2,116.28 28.04,115.44 28.04,114.99 NOTA.4
N$7
  Top 0.152: NOTA.5 29.41,114.91 29.41,105.39 30.71,104.09 30.71,101.96 30.86,101.8 31.7,101.8 31.93,102.03 31.93,104.17 32.16,104.39 32.92,104.39 33.76,103.56 33.76,103.1 NOT1.8
N$8
  Top 0.152: NOT2.4 30.02,76.96 30.02,77.72 33.22,80.92 33.22,99.21 34.52,100.51 34.52,101.19 36.5,103.17 36.5,112.47 34.52,114.45 34.52,114.91 NOTA.9
N$9  (via drill 0.35)
  Top 0.152: v34.44,90.3 34.44,81.69 32.61,79.86 32.61,76.96 NOT2.6 | v36.42,92.28 36.42,99.97 v36.5,100.05
  Bottom 0.152: v36.42,92.28 v34.44,90.3 | v36.5,100.05 36.5,112.47 34.52,114.45 34.52,114.91 NOTB.2
N$10  (via drill 0.35)
  Top 0.152: v27.2,61.42 30.71,57.91 30.71,55.4 31.39,54.71 32,54.71 33.22,55.93 33.22,62.48 33.76,63.02 NOT3.8
  Bottom 0.152: v27.2,61.42 22.48,66.14 22.48,108.2 26.14,111.86 26.14,115.98 26.44,116.28 28.5,116.28 29.34,115.44 29.34,114.99 NOTB.6
N$11  (via drill 0.35)
  Top 0.152: v34.67,95.94 33.53,94.79 33.53,91.67 33.76,91.44 33.76,83.13 NOT2.8
  Bottom 0.152: v34.67,95.94 34.67,96.62 31.24,100.05 31.24,112.17 33.15,114.07 33.15,114.91 NOTB.3
N$12  (via drill 0.35)
  Top 0.152: v27.2,67.44 28.04,66.6 28.04,62.03 32.54,57.53 32.54,57 NOT3.6
  Bottom 0.152: v27.2,67.44 27.2,77.42 22.78,81.84 22.78,105.16 28.04,110.41 28.04,114.91 NOTB.7
N$13  (via drill 0.35)
  Top 0.152: v24.99,108.28 24.99,62.56 29.95,57.61 29.95,57 NOT3.4
  Bottom 0.152: v24.99,108.28 24.99,110.26 26.82,112.09 26.82,114.91 NOTB.8
N$14  (via drill 0.35)
  Top 0.152: v29.41,91.44 31.24,89.61 31.24,83.13 NOT2.10
  Bottom 0.152: v29.41,91.44 23.09,97.77 23.09,105 31.85,113.77 31.85,114.91 NOTB.4
N$15  (via drill 0.35)
  Top 0.152: v28.8,95.02 28.8,83.13 NOT2.12
  Bottom 0.152: v28.8,95.02 28.8,110.19 32.54,113.92 32.54,116.05 32.31,116.28 31.47,116.28 30.71,115.52 30.71,114.99 NOTB.5
N$16  (via drill 0.35)
  Top 0.152: v23.09,112.09 23.09,64.01 27.43,59.66 27.43,57 NOT3.2
  Bottom 0.152: v23.09,112.09 25.53,114.53 25.53,114.91 NOTB.9
N$17
  Top 0.152: ANDA.2 115.59,114.91 115.59,108.97 116.66,107.9 116.66,104.32 116.89,104.09 116.89,99.21 118.72,97.38 118.72,97 AND1.3
N$18  (via drill 0.35)
  Top 0.152: v118.8,109.5 116.89,111.4 116.89,114.91 ANDA.3 | v124.74,104.78 124.74,100.74 122.61,98.6 122.61,97 AND1.6
  Bottom 0.152: v118.8,109.5 120.02,109.5 v124.74,104.78
N$19
  Top 0.152: AND1.8 123.75,103.1 123.75,104.39 120.7,107.44 120.7,113.31 121.23,113.84 121.23,116.05 121.01,116.28 118.95,116.28 118.11,115.44 118.11,114.99 ANDA.4
N$20
  Top 0.152: ANDA.5 119.41,114.91 119.41,103.63 119.94,103.1 AND1.11
N$21  (via drill 0.35)
  Top 0.152: v115.44,107.06 114.07,105.69 114.07,83.52 118.72,78.87 118.72,76.96 AND2.3 | v120.02,111.63 120.02,114.3 120.62,114.91 ANDA.6
  Bottom 0.152: v120.02,111.63 v115.44,107.06
N$22
  Top 0.152: ANDA.7 121.84,114.91 121.84,113 121.01,112.17 121.01,107.59 124.44,104.17 124.44,101.8 120.62,97.99 120.62,91.36 119.41,90.14 119.41,80.47 122.53,77.34 122.53,76.96 AND2.6
N$23  (via drill 0.35)
  Top 0.152: v130.45,91.14 130.45,106.53 123.22,113.77 123.22,114.91 ANDA.8 | v123.98,84.66 123.98,83.29 123.83,83.13 AND2.8
  Bottom 0.152: v123.98,84.66 v130.45,91.14
N$24  (via drill 0.35)
  Top 0.152: v125.35,109.8 125.35,100.89 123.22,98.75 123.22,93.5 120.02,90.3 120.02,83.13 AND2.11 | v125.35,112.7 125.35,113.61 124.51,114.45 124.51,114.91 ANDA.9
  Bottom 0.152: v125.35,112.7 v125.35,109.8
N$25  (via drill 0.35)
  Top 0.152: v118.72,58.52 118.72,57 AND3.3 | v124.13,74.83 128.63,79.32 v128.63,106.53
  Bottom 0.152: v118.72,58.52 119.79,58.52 124.13,62.87 v124.13,74.83 | v128.63,106.53 128.63,110.34 124.51,114.45 124.51,114.91 ANDB.2
N$26  (via drill 0.35)
  Top 0.152: v122.61,60.43 122.61,57 AND3.6 | v124.74,76.35 124.74,81.38 127.41,84.05 v127.41,106.83
  Bottom 0.152: v122.61,60.43 122.61,60.88 124.74,63.02 v124.74,76.35 | v127.41,106.83 123.22,111.02 123.22,114.91 ANDB.3
N$27  (via drill 0.35)
  Top 0.152: v125.65,62.03 125.65,62.33 124.97,63.02 123.83,63.02 AND3.8 | v125.65,72.69 131.06,78.11 v131.06,105.23
  Bottom 0.152: v125.65,72.69 v125.65,62.03 | v131.06,105.23 129.01,105.23 128.32,104.55 127.71,104.55 122.22,110.03 122.22,114.61 121.92,114.91 ANDB.4
N$28  (via drill 0.35)
  Top 0.152: v119.94,59.74 119.41,59.74 118.87,60.27 118.87,60.88 119.94,61.95 119.94,63.02 AND3.11 | v125.35,77.88 125.35,81.53 128.02,84.2 v128.02,105.16
  Bottom 0.152: v119.94,59.74 120.55,59.74 123.52,62.71 123.52,76.05 v125.35,77.88 | v128.02,105.16 122.53,110.64 122.53,116.05 122.3,116.28 121.54,116.28 120.7,115.44 120.7,114.99 ANDB.5
N$29  (via drill 0.35)
  Top 0.152: v118.72,39.93 118.72,36.96 AND4.3 | v129.84,77.88 129.84,106.68 124.66,111.86 v121.61,111.86
  Bottom 0.152: v118.72,39.93 118.72,53.03 117.04,54.71 117.04,55.63 118.03,56.62 129.54,56.62 129.84,56.92 v129.84,77.88 | v121.61,111.86 121.61,112.32 119.41,114.53 119.41,114.91 ANDB.6
N$30  (via drill 0.35)
  Top 0.152: v121.16,39.09 122.53,37.72 122.53,36.96 AND4.6 | v124.44,53.65 123.67,53.65 121.84,55.47 121.84,59.13 v120.4,60.58 | v113.39,76.05 113.39,76.81 113.61,77.04 v113.61,111.33
  Bottom 0.152: v121.16,39.09 121.16,42.14 124.13,45.11 124.13,53.34 v124.44,53.65 | v120.4,60.58 113.39,67.59 v113.39,76.05 | v113.61,111.33 116.2,113.92 116.2,116.05 116.43,116.28 117.2,116.28 118.03,115.44 118.03,114.99 ANDB.7
N$31  (via drill 0.35)
  Top 0.152: v124.74,43.36 124.51,43.13 123.83,43.13 AND4.8 | v129.24,57.23 v124.74,52.73 | v129.24,77.19 129.24,106.83 125.12,110.95 v121.61,110.95
  Bottom 0.152: v124.74,52.73 v124.74,43.36 | v129.24,77.19 v129.24,57.23 | v121.61,110.95 118.87,113.69 117.65,113.69 116.89,114.45 116.89,114.91 ANDB.8
N$32  (via drill 0.35)
  Top 0.152: v116.36,41.15 116.66,40.84 118.19,40.84 119.94,42.6 119.94,43.05 AND4.11 | v108.36,77.88 108.36,99.29 110.8,101.73 v110.8,109.8
  Bottom 0.152: v116.36,41.15 116.36,45.49 108.36,53.49 v108.36,77.88 | v110.8,109.8 115.52,114.53 115.52,114.91 ANDB.9
N$33
  Top 0.152: OR1.3 148.67,97 148.67,99.36 146.76,101.27 146.76,113.31 145.62,114.45 145.62,114.91 ORA.2
N$34
  Top 0.152: OR1.6 152.48,96.93 152.48,96.39 150.5,94.41 148.9,94.41 148.06,95.25 148.06,99.52 144.93,102.64 144.93,116.05 145.16,116.28 145.92,116.28 146.76,115.44 146.76,114.99 ORA.3
N$35
  Top 0.152: ORA.4 148.13,114.91 148.13,101.96 149.96,100.13 151.33,100.13 153.77,102.56 153.77,103.02 OR1.8
N$36
  Top 0.152: OR1.11 149.96,103.1 149.96,114.38 149.43,114.91 ORA.5
N$37  (via drill 0.35)
  Top 0.152: v149.35,79.1 148.74,78.49 148.74,76.96 OR2.3 | v154.23,80.85 154.23,81.31 163.22,90.3 v163.22,101.73 | v155.91,108.89 155.91,109.04 150.65,114.3 150.65,114.91 ORA.6
  Bottom 0.152: v149.35,79.1 152.48,79.1 v154.23,80.85 | v163.22,101.73 163.07,101.73 v155.91,108.89
N$38  (via drill 0.35)
  Top 0.152: v162.61,103.1 162.61,90.14 152.55,80.09 152.55,76.96 OR2.6 | v156.06,109.8 155.6,109.8 151.94,113.46 151.94,114.91 ORA.7
  Bottom 0.152: v162.61,103.1 156.06,109.65 v156.06,109.8
N$39  (via drill 0.35)
  Top 0.152: v162,108.28 162,94.11 153.85,85.95 153.85,83.13 OR2.8 | v162,110.57 155.45,117.12 154.76,117.12 153.24,115.59 153.24,114.99 ORA.8
  Bottom 0.152: v162,110.57 v162,108.28
N$40  (via drill 0.35)
  Top 0.152: v155.37,111.4 156.13,111.4 161.7,105.84 161.7,94.26 153.24,85.8 153.24,81.31 152.78,80.85 151.79,80.85 150.04,82.6 150.04,83.06 OR2.11 | v154.15,112.62 154.15,114.68 154.38,114.91 ORA.9
  Bottom 0.152: v154.15,112.62 v155.37,111.4
N$41  (via drill 0.35)
  Top 0.152: v150.5,59.13 148.74,57.38 148.74,57 OR3.3 | v160.32,86.49 v160.32,77.72 | v160.32,93.8 160.32,98.37 160.48,98.53 160.48,102.41 156.67,106.22 156.67,110.11 155.98,110.8 155.07,110.8 154.76,111.1 154.76,113.61 155.07,113.92 v155.07,116.51
  Bottom 0.152: v150.5,59.13 150.88,59.13 156.59,64.85 156.59,73.99 v160.32,77.72 | v160.32,93.8 v160.32,86.49 | v155.07,116.51 155.07,115.59 154.46,114.99 ORB.2
N$42  (via drill 0.35)
  Top 0.152: v159.94,59.74 154.15,53.95 153.54,53.95 152.55,54.94 152.55,56.92 OR3.6 | v166.88,79.25 167.49,79.86 167.49,112.47 v167.26,112.7
  Bottom 0.152: v159.94,59.74 159.94,72.31 v166.88,79.25 | v167.26,112.7 156.29,112.7 155.6,113.39 151.79,113.39 151.33,113.84 151.33,116.13 151.49,116.28 152.32,116.28 153.16,115.44 153.16,114.99 ORB.3
N$43  (via drill 0.35)
  Top 0.152: v157.5,66.75 153.85,63.09 OR3.8 | v166.88,80.16 166.88,112.17 v165.74,113.31
  Bottom 0.152: v157.5,66.75 157.5,70.79 v166.88,80.16 | v165.74,113.31 156.13,113.31 155.75,113.69 152.78,113.69 151.94,114.53 151.94,114.91 ORB.4
N$44  (via drill 0.35)
  Top 0.152: v156.9,63.09 154.69,60.88 151.26,60.88 150.04,62.1 150.04,63.02 OR3.11 | v164.74,80.16 164.74,108.74 156.06,117.42 153.77,117.42 v152.93,116.59
  Bottom 0.152: v156.9,63.09 156.9,72.31 v164.74,80.16 | v152.93,116.59 151.33,116.59 150.65,115.9 150.65,114.99 ORB.5
N$45  (via drill 0.35)
  Top 0.152: v181.97,41.38 181.97,35.89 180.52,34.44 150.8,34.44 148.74,36.5 148.74,36.88 OR4.3 | v185.7,45.11 185.7,79.48 183.11,82.07 183.11,87.94 v180.75,90.3 | v158.95,98.83 158.95,103.48 v150.57,111.86
  Bottom 0.152: v185.7,45.11 v181.97,41.38 | v180.75,90.3 180.75,92.43 174.96,98.22 159.56,98.22 v158.95,98.83 | v150.57,111.86 150.57,113.31 149.43,114.45 149.43,114.91 ORB.6
N$46  (via drill 0.35)
  Top 0.152: v143.26,115.67 143.26,101.58 146.76,98.07 146.76,86.26 140.44,79.93 v140.44,77.88 | v144.63,54.56 v142.88,56.31 | v152.48,39.32 152.48,36.96 OR4.6
  Bottom 0.152: v143.26,115.67 143.87,116.28 144.7,116.28 144.86,116.13 144.86,114 145.16,113.69 147.22,113.69 148.06,114.53 148.06,114.91 ORB.7 | v140.44,77.88 140.44,58.75 v142.88,56.31 | v144.63,54.56 144.63,47.17 v152.48,39.32
N$47  (via drill 0.35)
  Top 0.152: v137.01,77.88 v137.01,110.8 | v145.24,52.81 v141.96,56.08 | v154.69,43.36 154.08,43.36 153.85,43.13 OR4.8
  Bottom 0.152: v137.01,110.8 143.1,116.89 145.31,116.89 146.76,115.44 146.76,114.99 ORB.8 | v137.01,77.88 137.01,61.04 v141.96,56.08 | v154.69,43.36 v145.24,52.81
N$48  (via drill 0.35)
  Top 0.152: v142.04,105.99 142.04,81.99 v133.12,73.08 | v138.3,51.21 v133.12,56.39 | v149.35,41.53 149.35,42.44 149.96,43.05 OR4.11
  Bottom 0.152: v142.04,105.99 142.04,115.37 143.26,116.59 144.86,116.59 145.54,115.9 145.54,114.99 ORB.9 | v133.12,56.39 v133.12,73.08 | v138.3,51.21 139.68,51.21 v149.35,41.53
N$49
  Top 0.152: XORA.2 175.56,114.91 175.56,105.39 176.86,104.09 176.86,99.21 178.69,97.38 178.69,97 XOR1.3
N$50
  Top 0.152: XOR1.6 182.5,97 182.5,98.15 179.3,101.35 179.3,104.93 176.94,107.29 176.94,114.83 176.86,114.91 XORA.3
N$51  (via drill 0.35)
  Top 0.152: v178.16,109.19 178.16,114.91 XORA.4 | v182.73,104.62 183.79,103.56 183.79,103.1 XOR1.8
  Bottom 0.152: v182.73,104.62 v178.16,109.19
N$52
  Top 0.152: XORA.5 179.38,114.91 179.38,105.31 179.98,104.7 179.98,103.1 XOR1.11
N$53  (via drill 0.35)
  Top 0.152: v179.38,78.41 178.76,77.8 178.76,76.96 XOR2.3 | v181.66,104.78 181.66,110.03 179.68,112.01 179.68,113.61 180.59,114.53 180.59,114.91 XORA.6
  Bottom 0.152: v179.38,78.41 179.38,79.93 181.66,82.22 v181.66,104.78
N$54  (via drill 0.35)
  Top 0.152: v182.27,78.49 182.5,78.26 182.5,76.96 XOR2.6 | v185.47,107.82 183.49,109.8 183.49,112.93 181.97,114.45 181.97,114.91 XORA.7
  Bottom 0.152: v182.27,78.49 182.27,90.91 185.47,94.11 v185.47,107.82
N$55  (via drill 0.35)
  Top 0.152: v183.87,93.42 183.87,83.13 XOR2.8 | v184.86,109.35 184.86,109.8 183.79,110.87 183.79,113.46 183.19,114.07 183.19,114.91 XORA.8
  Bottom 0.152: v183.87,93.42 183.87,100.66 184.86,101.65 v184.86,109.35
N$56
  Top 0.152: XOR2.11 180.06,83.13 180.06,90.53 188.21,98.68 188.21,107.37 184.48,111.1 184.48,114.91 XORA.9
N$57  (via drill 0.35)
  Top 0.152: v180.59,60.66 180.59,55.78 180.44,55.63 179.6,55.63 178.76,56.46 178.76,56.92 XOR3.3 | v187,107.67 187,108.13 184.1,111.02 184.1,113.61 183.87,113.84 v183.87,116.51
  Bottom 0.152: v180.59,60.66 179.98,61.27 179.98,61.95 187,68.96 v187,107.67 | v183.87,116.51 183.87,115.52 184.4,114.99 XORB.2
N$58  (via drill 0.35)
  Top 0.152: v182.57,61.19 182.57,57 XOR3.6 | v185.09,112.62 v188.21,109.5
  Bottom 0.152: v182.57,61.19 182.57,63.63 188.21,69.27 v188.21,109.5 | v185.09,112.62 183.19,114.53 183.19,114.91 XORB.3
N$59  (via drill 0.35)
  Top 0.152: v181.97,111.71 181.97,111.1 182.88,110.19 182.88,108.28 186.38,104.78 v186.38,97.77 | v183.87,66.75 183.87,63.09 XOR3.8
  Bottom 0.152: v181.97,111.71 181.97,114.91 XORB.4 | v186.38,97.77 186.38,69.27 v183.87,66.75
N$60  (via drill 0.35)
  Top 0.152: v180.59,61.57 180.06,62.1 180.06,63.02 XOR3.11 | v187.6,103.56 187.6,104.78 183.19,109.19 183.19,111.56 v181.28,113.46
  Bottom 0.152: v180.59,61.57 180.59,62.1 187.6,69.11 v187.6,103.56 | v181.28,113.46 181.28,114.3 180.67,114.91 XORB.5
N$61  (via drill 0.35)
  Top 0.152: v178.76,40.39 178.76,36.96 XOR4.3 | v183.26,94.64 184.4,95.78 184.4,106.3 181.97,108.74 181.97,110.64 v180.29,112.32
  Bottom 0.152: v178.76,40.39 178.76,43.74 179.38,44.35 179.38,77.5 181.97,80.09 181.97,93.34 v183.26,94.64 | v180.29,112.32 180.29,113.61 179.38,114.53 179.38,114.91 XORB.6
N$62  (via drill 0.35)
  Top 0.152: v185.09,111.4 185.09,110.95 188.52,107.52 v188.52,43.36 | v183.64,38.48 182.57,37.41 182.57,36.96 XOR4.6
  Bottom 0.152: v185.09,111.4 184.78,111.1 180.59,111.1 178.16,113.54 178.16,114.91 XORB.7 | v183.64,38.48 v188.52,43.36
N$63  (via drill 0.35)
  Top 0.152: v173.28,115.67 173.28,85.04 170.61,82.37 170.61,81.76 172.44,79.93 182.65,79.93 185.09,77.5 v185.09,45.8 | v183.95,44.65 183.95,43.2 183.87,43.13 XOR4.8
  Bottom 0.152: v173.28,115.67 173.89,116.28 175.95,116.28 176.78,115.44 176.78,114.99 XORB.8 | v183.95,44.65 v185.09,45.8
N$64  (via drill 0.35)
  Top 0.152: v176.33,106.45 v176.33,113.39 | v178.76,44.65 179.07,44.35 179.15,44.35 179.98,43.51 179.98,43.13 XOR4.11
  Bottom 0.152: v176.33,113.39 175.56,114.15 175.56,114.91 XORB.9 | v176.33,106.45 181.36,101.42 181.36,82.37 178.76,79.78 v178.76,44.65
N$65
  Top 0.152: NANDA.2 55.63,114.91 55.63,110.41 59.97,106.07 59.97,103.1 NAND1.11
N$66  (via drill 0.35)
  Top 0.152: v61.27,111.1 61.27,110.64 63.78,108.13 63.78,103.1 NAND1.8 | v59.36,112.01 56.84,114.53 56.84,114.91 NANDA.3
  Bottom 0.152: v61.27,111.1 60.27,111.1 v59.36,112.01
N$67
  Top 0.152: NANDA.4 58.14,114.91 58.14,114.45 58.9,113.69 59.82,113.69 60.05,113.92 60.05,116.05 60.27,116.28 62.33,116.28 62.56,116.05 62.56,113.54 63.78,112.32 63.78,108.58 64.08,108.28 64.08,104.47 64.39,104.17 64.39,100.2 62.56,98.37 62.56,97 NAND1.6
N$68
  Top 0.152: NAND1.3 58.67,97 58.67,100.13 56.77,102.03 56.77,108.81 54.94,110.64 54.94,116.05 55.17,116.28 58.52,116.28 59.36,115.44 59.36,114.99 NANDA.5
N$69  (via drill 0.35)
  Top 0.152: v65.3,99.29 65.3,96.7 60.05,91.44 60.05,83.13 NAND2.11 | v63.17,101.42 63.17,108.28 60.66,110.8 60.66,114.91 NANDA.6
  Bottom 0.152: v63.17,101.42 v65.3,99.29
N$70  (via drill 0.35)
  Top 0.152: v69.42,103.94 69.42,99.9 63.86,94.34 63.86,83.13 NAND2.8 | v63.17,109.65 63.17,112.47 61.95,113.69 61.95,114.91 NANDA.7
  Bottom 0.152: v69.42,103.94 63.7,109.65 v63.17,109.65
N$71
  Top 0.152: NAND2.6 62.48,76.89 62.48,76.43 61.72,75.67 57,75.67 56.77,75.89 56.77,79.55 53.72,82.6 53.72,116.2 55.17,117.65 61.42,117.65 63.17,115.9 63.17,114.99 NANDA.8
N$72  (via drill 0.35)
  Top 0.152: v55.32,102.72 54.1,101.5 54.1,82.68 57.07,79.7 57.53,79.7 58.67,78.56 58.67,76.96 NAND2.3 | v64.39,110.19 64.39,114.91 NANDA.9
  Bottom 0.152: v55.32,102.72 62.87,110.26 64.31,110.26 v64.39,110.19
N$73  (via drill 0.35)
  Top 0.152: v71.17,112.62 74.07,109.73 74.07,78.03 73.76,77.72 73.15,77.72 72.69,78.18 63.32,78.18 63.25,78.11 63.25,75.82 63.4,75.67 64.24,75.67 64.54,75.97 73.99,75.97 74.3,75.67 74.3,75.06 73.99,74.75 66.22,74.75 59.97,68.5 59.97,63.09 NAND3.11
  Bottom 0.152: v71.17,112.62 66.37,112.62 64.47,114.53 64.47,114.91 NANDB.2
N$74  (via drill 0.35)
  Top 0.152: v63.02,69.72 63.78,68.96 63.78,63.09 NAND3.8 | v71.4,81.15 71.4,110.03 v69.42,112.01
  Bottom 0.152: v63.02,69.72 63.02,72.77 v71.4,81.15 | v69.42,112.01 65.68,112.01 63.25,114.45 63.25,114.91 NANDB.3
N$75  (via drill 0.35)
  Top 0.152: v62.48,58.52 62.48,57 NAND3.6 | v60.66,60.35 60.66,60.73 59.36,62.03 59.36,72.01 v56.62,74.75 | v62.87,84.89 62.87,93.8 68.81,99.75 68.81,113.61 65.91,116.51 v63.78,116.51
  Bottom 0.152: v60.66,60.35 v62.48,58.52 | v56.62,74.75 56.62,78.64 v62.87,84.89 | v63.78,116.51 63.02,116.51 61.95,115.44 61.95,114.99 NANDB.4
N$76  (via drill 0.35)
  Top 0.152: v58.06,60.05 58.67,59.44 58.67,57 NAND3.3 | v73.46,78.33 73.46,109.42 65.76,117.12 v62.87,117.12
  Bottom 0.152: v58.06,60.05 58.06,63.7 60.88,66.52 61.65,66.52 v73.46,78.33 | v62.87,117.12 62.33,117.12 60.66,115.44 60.66,114.99 NANDB.5
N$77  (via drill 0.35)
  Top 0.152: v47.47,112.17 47.47,110.34 39.78,102.64 v39.78,71.17 | v56.92,47.55 59.97,44.5 59.97,43.13 NAND4.11
  Bottom 0.152: v47.47,112.17 52.81,117.5 56.46,117.5 57.53,116.43 58.37,116.43 59.36,115.44 59.36,114.99 NANDB.6 | v39.78,71.17 39.78,63.78 56.01,47.55 v56.92,47.55
N$78  (via drill 0.35)
  Top 0.152: v53.11,73.61 v53.11,116.89 | v53.11,68.05 53.11,67.89 56.77,64.24 56.77,59.21 55.63,58.06 55.63,51.66 63.78,43.51 63.78,43.13 NAND4.8
  Bottom 0.152: v53.11,116.89 56.62,116.89 58.06,115.44 58.06,114.99 NANDB.7 | v53.11,68.05 v53.11,73.61
N$79  (via drill 0.35)
  Top 0.152: v59.21,40.16 60.73,40.16 62.48,38.41 62.48,36.96 NAND4.6 | v34.59,78.64 34.59,80.47 39.47,85.34 39.47,105.08 50.22,115.82 v52.5,115.82
  Bottom 0.152: v59.21,40.16 55.09,40.16 40.54,54.71 31.39,54.71 31.09,55.02 31.09,75.13 v34.59,78.64 | v52.5,115.82 52.96,115.82 53.72,116.59 55.63,116.59 56.77,115.44 56.77,114.99 NANDB.8
N$80  (via drill 0.35)
  Top 0.152: v60.58,39.4 60.58,35.81 60.43,35.66 59.59,35.66 58.75,36.5 58.75,36.88 NAND4.3 | v40.46,70.56 40.46,102.87 v52.5,114.91
  Bottom 0.152: v60.58,39.4 60.58,43.36 61.8,44.58 61.8,45.19 53.72,53.26 50.75,53.26 40.46,63.55 v40.46,70.56 | v52.5,114.91 53.87,116.28 54.71,116.28 55.55,115.44 55.55,114.99 NANDB.9
N$81
  Top 0.152: NORA.2 85.57,114.91 85.57,95.86 86.64,94.79 88.39,94.79 89.99,96.39 NOR1.4
N$82
  Top 0.152: NOR1.1 86.18,97 86.18,101.35 86.79,101.96 86.79,114.91 NORA.3
N$83
  Top 0.152: NORA.4 88.16,114.99 88.16,115.44 89,116.28 91.06,116.28 91.21,116.13 91.21,103.1 NOR1.10
N$84
  Top 0.152: NOR1.13 87.48,103.1 87.48,112.62 89.31,114.45 89.31,114.91 NORA.5
N$85  (via drill 0.35)
  Top 0.152: v84.35,109.27 84.35,82.07 86.18,80.24 86.18,76.96 NOR2.1 | v88.09,111.71 88.09,112.01 90.6,114.53 90.6,114.91 NORA.6
  Bottom 0.152: v84.35,109.27 85.65,109.27 v88.09,111.71
N$86  (via drill 0.35)
  Top 0.152: v97.46,119.56 97.46,116.28 97.54,116.2 97.54,112.78 95.02,110.26 95.02,106.53 95.33,106.22 95.33,96.62 99.06,92.89 99.06,80.54 98.75,80.24 92.89,80.24 90.07,77.42 90.07,76.96 NOR2.4 | v91.97,116.66 91.97,114.99 NORA.7
  Bottom 0.152: v97.46,119.56 94.87,119.56 v91.97,116.66
N$87
  Top 0.152: NOR2.10 91.29,83.13 91.29,93.95 93.19,95.86 93.19,104.85 92.66,105.39 92.66,113.54 93.12,114 93.12,114.91 NORA.8
N$88
  Top 0.152: NOR2.13 87.48,83.13 87.48,92.66 90.68,95.86 90.68,98.07 91.75,99.14 91.75,101.8 91.97,102.03 91.97,113.31 92.58,113.92 92.58,116.05 92.81,116.28 93.57,116.28 94.41,115.44 94.41,114.99 NORA.9
N$89  (via drill 0.35)
  Top 0.152: v86.87,55.4 86.26,56.01 86.26,56.92 NOR3.1 | v101.65,77.42 101.65,91.67 98.6,94.72 98.6,113.08 98.75,113.23 98.75,118.19 v98.07,118.87
  Bottom 0.152: v86.87,55.4 93.95,55.4 96.01,57.45 96.01,71.78 v101.65,77.42 | v98.07,118.87 97,118.87 94.49,116.36 94.49,114.99 NORB.2
N$90  (via drill 0.35)
  Top 0.152: v90.14,59.44 90.37,59.66 91.75,59.66 92.05,59.36 92.05,58.75 91.97,58.67 91.97,55.93 91.67,55.63 90.83,55.63 90.07,56.39 90.07,56.92 NOR3.4 | v76.96,76.89 76.96,110.87 83.82,117.73 92.28,117.73 v93.12,116.89
  Bottom 0.152: v90.14,59.44 88.7,60.88 88.7,65.15 v76.96,76.89 | v93.12,116.89 93.12,114.99 NORB.3
N$91  (via drill 0.35)
  Top 0.152: v88.01,66.75 91.21,63.55 91.21,63.09 NOR3.10 | v82.14,114.68 v82.14,77.27
  Bottom 0.152: v88.01,66.75 87.86,66.75 82.14,72.47 v82.14,77.27 | v82.14,114.68 82.14,115.14 85.04,118.03 89.31,118.03 91.9,115.44 91.9,114.99 NORB.4